# Altium schematic sheet Ideal Diode Implementation.SchDoc
size A; SheetNumber: 2; SheetTotal: 2
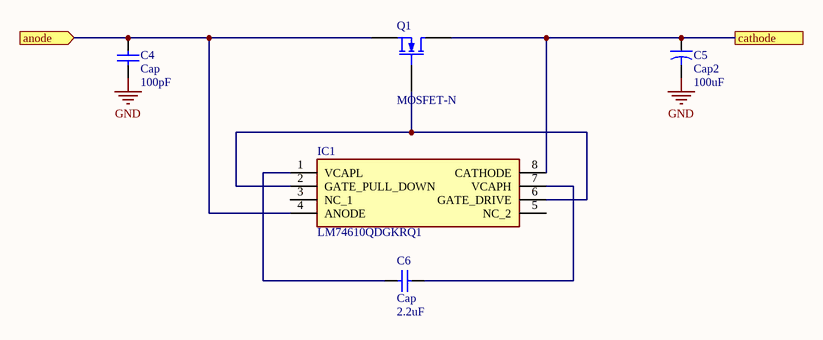
[diagram p0: Ideal Diode Implementation.SchDoc]

## Parts
C4  Cap  value 100pF  [RAD-0.3]
C5  Cap2  value 100uF  [CAPR5-4X5]
C6  Cap  value 2.2uF  [RAD-0.3]
IC1  LM74610QDGKRQ1  [SOP65P490X110-8N]
Q1  MOSFET-N  [E3]

## Ports
anode (in), cathode

## Nets
GND: C4.1 C5.2
anode: C4.2 IC1.4(ANODE) Q1.3(S) ; port anode
cathode: C5.1 IC1.8(CATHODE) Q1.1(D) ; port cathode
NetC6_1: C6.1 IC1.1(VCAPL)
NetC6_2: C6.2 IC1.7(VCAPH)
NetIC1_2: IC1.2(GATE_PULL_DOWN) IC1.6(GATE_DRIVE) Q1.2(G)

Not connected (* = marked no-connect by the designer): IC1 3(NC_1) 5(NC_2)

## Library data of the parts
C4 C6 = Cap: Capacitor; Published: 8-Jun-2000; LatestRevisionDate: 17-Jul-2002; LatestRevisionNote: Re-released for DXP Platform.; PackageReference: RAD-0.3; Publisher: Altium Limited; PackageDescription: Radial Cap, Thru-Hole; 2 Leads; 0.3 in Pin Spacing
C5 = Cap2: Capacitor; Published: 23-Sep-2002; PackageReference: CAPR5-4X5; Publisher: Altium Limited; PackageDescription: Capacitor; 2 Leads
IC1 = LM74610QDGKRQ1: Integrated Circuit; Manufacturer_Name: Texas Instruments; Datasheet Link: http://www.ti.com/lit/gpn/lm74610-q1; Height: 1.1mm; Manufacturer_Part_Number: LM74610QDGKRQ1; Mouser Part Number: 595-LM74610QDGKRQ1; Mouser Price/Stock: https://www.mouser.co.uk/ProductDetail/Texas-Instruments/LM74610QDGKRQ1?qs=3jdCaFhktOQTVpuuubgDqg%3D%3D; Arrow Part Number: LM74610QDGKRQ1; Arrow Price/Stock: https://www.arrow.com/en/products/lm74610qdgkrq1/texas-instruments
Q1 = MOSFET-N: N-Channel MOSFET; Published: 8-Jun-2000; LatestRevisionDate: 17-Jul-2002; LatestRevisionNote: Re-released for DXP Platform.; PackageVersion: 1995/1996; PackageReference: E3; Publisher: Altium Limited; PackageDescription: TO, Flat Index; 3 In-Line, Axial Leads; Body Dia. 4.6mm; Lead Dia. 0.5 mm (max)